# Altium schematic sheet IM69D130_MEMS_Microphone.SchDoc: IM69D130 PDM MEMS Microphone
size A4; DocumentNumber: 5; SheetNumber: 5; SheetTotal: 31
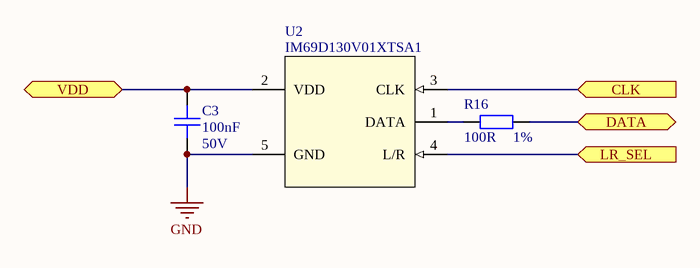
[diagram p0: IM69D130_MEMS_Microphone.SchDoc]

## Parts
C3  Capacitance: 100nF  Voltage: 50V  [C0402]  (hidden comment: CAP CER 0.1UF 50V X7R 0402)
R16  Tolerance: 1%  Resistance: 100R  [0402R]  (hidden comment: RES SMD 100 OHM 1% 1/16W 0402)
U2  IM69D130V01XTSA1  [MIC_IM69D130V01XTSA1]

## Ports
CLK (in), DATA, LR_SEL (in), VDD

## Nets
GND: C3.1 U2.5(GND)
CLK: U2.3(CLK) ; port CLK
DATA: R16.1 ; port DATA
LR_SEL: U2.4(L/R) ; port LR_SEL
VDD: C3.2 U2.2(VDD) ; port VDD
NetR16_2: R16.2 U2.1(DATA)

## Notes on the sheet
- Title
- Size:
- Date:
- A4
- Number:
- Time:
- Revision:
- Sheet
- of
- File:

## Library data of the parts
C3 = CAP CER 0.1UF 50V X7R 0402: 0.1µF ±10% 50V Ceramic Capacitor X7R 0402 (1005 Metric); Manufacturer: TDK; Manufacturer Part Number: CGA2B3X7R1H104K050BB; Supplier 1: Digi-Key; Stock 1: 2925303; Pricing 1: 1=0.17, 10=0.118, 50=0.0668, 100=0.0553, 500=0.0388, 1000=0.0321, 2500=0.0299, 5000=0.0273 (USD); Mount: Surface Mount; Case/Package: 0402; Weight: 2.3E-05oz; Case Code (Metric): 1005; Case Code (Imperial): 0402; Min Operating Temperature: -55°C; Max Operating Temperature: 125°C; Voltage Rating: 50V; Tolerance: 10%; Packaging: Tape and Reel; Package Quantity: 1; Voltage Rating (DC): 50V; Dielectric: X7R; Termination: SMD/SMT; Composition: Ceramic; Length: 1mm; Height: 0.5mm; Width: 0.02inch; Thickness: 0.022inch; Depth: 0.5mm; Ratings: AEC-Q200; REACH SVHC: No SVHC; Lead Free: Lead Free; ComponentLink1URL: http://product.tdk.com/capacitor/mlcc/en/documents/mlccspec_automotive_general_midvoltage_en.pdf?src-supplier=Future+Electronics; ComponentLink1Description: http://product.tdk.com/capacitor/mlcc/en/documents/mlccspec_automotive_general_midvoltage_en.pdf?src-supplier=Future+Electronics; ComponentLink2URL: http://www.farnell.com/datasheets/1807242.pdf?src-supplier=Element14; ComponentLink2Description: http://www.farnell.com/datasheets/1807242.pdf?src-supplier=Element14; ComponentLink3URL: http://www.mouser.com/ds/2/400/lcc_automotive_general_en-843974.pdf?src-supplier=Mouser; ComponentLink3Description: http://www.mouser.com/ds/2/400/lcc_automotive_general_en-843974.pdf?src-supplier=Mouser; ComponentLink4URL: http://www.farnell.com/datasheets/1936565.pdf?src-supplier=Element14; ComponentLink4Description: http://www.farnell.com/datasheets/1936565.pdf?src-supplier=Element14; ComponentLink5URL: http://www.farnell.com/datasheets/1735392.pdf?src-supplier=Element14; ComponentLink5Description: http://www.farnell.com/datasheets/1735392.pdf?src-supplier=Element14; Supplier Part Number 1: 445-6899-1-ND
R16 = RES SMD 100 OHM 1% 1/16W 0402: 100 Ohms ±1% 0.063W, 1/16W Chip Resistor 0402 (1005 Metric) Moisture Resistant Thick Film; Manufacturer: Yageo; Manufacturer Part Number: RC0402FR-07100RL; Power Rating: 62.5mW; Voltage Rating: 50V; Temperature Coefficient: 100ppm/°C; Supplier 1: Digi-Key; Stock 1: 16989760; Pricing 1: 1=0.1, 10=0.016, 100=0.0064, 1000=0.0029, 2500=0.0025, 5000=0.0021 (USD); Case/Package: 0402; Number of Pins: 2; Case Code (Imperial): 0402; Case Code (Metric): 1005; Min Operating Temperature: -55°C; Max Operating Temperature: 155°C; Voltage Rating (DC): 50V; Packaging: Tape and Reel; Termination: SMD/SMT; Composition: Thick Film; Military Standard: Not; Length: 1mm; Height: 0.32mm; Width: 0.5mm; Depth: 0.5mm; REACH SVHC: No SVHC; Lead Free: Lead Free; ComponentLink1URL: http://www.farnell.com/datasheets/2167052.pdf?src-supplier=Element14; ComponentLink1Description: http://www.farnell.com/datasheets/2167052.pdf?src-supplier=Element14; ComponentLink2URL: http://www.yageo.com/documents/recent/PYu-RC_Group_51_RoHS_L_9.pdf?src-supplier=Mouser; ComponentLink2Description: http://www.yageo.com/documents/recent/PYu-RC_Group_51_RoHS_L_9.pdf?src-supplier=Mouser; ComponentLink3URL: http://www.yageo.com/documents/recent/PYu-RC0402_51_RoHS_L_6_r.pdf?src-supplier=Future+Electronics; ComponentLink3Description: http://www.yageo.com/documents/recent/PYu-RC0402_51_RoHS_L_6_r.pdf?src-supplier=Future+Electronics; ComponentLink4URL: https://www.verical.com/server-webapp/html/getDatasheet?partID=329466&src-supplier=Verical; ComponentLink4Description: https://www.verical.com/server-webapp/html/getDatasheet?partID=329466&src-supplier=Verical; ComponentLink5URL: http://www.farnell.com/datasheets/1018594.pdf?src-supplier=Element14; ComponentLink5Description: http://www.farnell.com/datasheets/1018594.pdf?src-supplier=Element14; ComponentLink6URL: http://documents.rs-components.com/techlib://itc_doclist_GB.htm?stockno=6185810&src-supplier=RSComponents; ComponentLink6Description: http://documents.rs-components.com/techlib://itc_doclist_GB.htm?stockno=6185810&src-supplier=RSComponents; Supplier Part Number 1: 311-100LRDKR-ND
U2 = IC IM69D130 MICROPHONE MEMS DIGITAL PDM OMNI: 20Hz ~ 20kHz Digital, PDM Microphone MEMS (Silicon) 1.62V ~ 3.6V Omnidirectional (-36dB ±1dB @ 94dB SPL) Solder Pads; Manufacturer: Infineon; Shape: Rectangular; Max Frequency: 3.3MHz; Operating Supply Voltage: -3.6V; Operating Supply Current: 1.3mA; Supplier 1: Digi-Key; Manufacturer Part Number: IM69D130V01XTSA1; Stock 1: 16861; Pricing 1: 1=1.76, 10=1.458, 25=1.3476, 50=1.2674, 100=1.19, 500=1.0214 (USD); Output Type: Digital; Direction: Omnidirectional; Packaging: Cut Tape; Termination: Solder; Lead Free: Lead Free; Halogen Free: Halogen Free; RoHS Compliant: Yes; ComponentLink1URL: http://www.farnell.com/datasheets/2718732.pdf?src-supplier=Newark; ComponentLink1Description: http://www.farnell.com/datasheets/2718732.pdf?src-supplier=Newark; ComponentLink2URL: https://www.infineon.com/dgdl/Infineon-IM69D130-DS-v01_00-EN.pdf?fileId=5546d462602a9dc801607a0e46511a2e&src-supplier=Digi-Key; ComponentLink2Description: https://www.infineon.com/dgdl/Infineon-IM69D130-DS-v01_00-EN.pdf?fileId=5546d462602a9dc801607a0e46511a2e&src-supplier=Digi-Key; ComponentLink3URL: http://www.farnell.com/datasheets/2718732.pdf?src-supplier=Farnell; ComponentLink3Description: http://www.farnell.com/datasheets/2718732.pdf?src-supplier=Farnell; Supplier Part Number 1: IM69D130V01XTSA1CT-ND